# EAGLE design Particle Xenon Featherwing (EAGLE 9.1.1)

## Sheet 1 of 3: Sensors
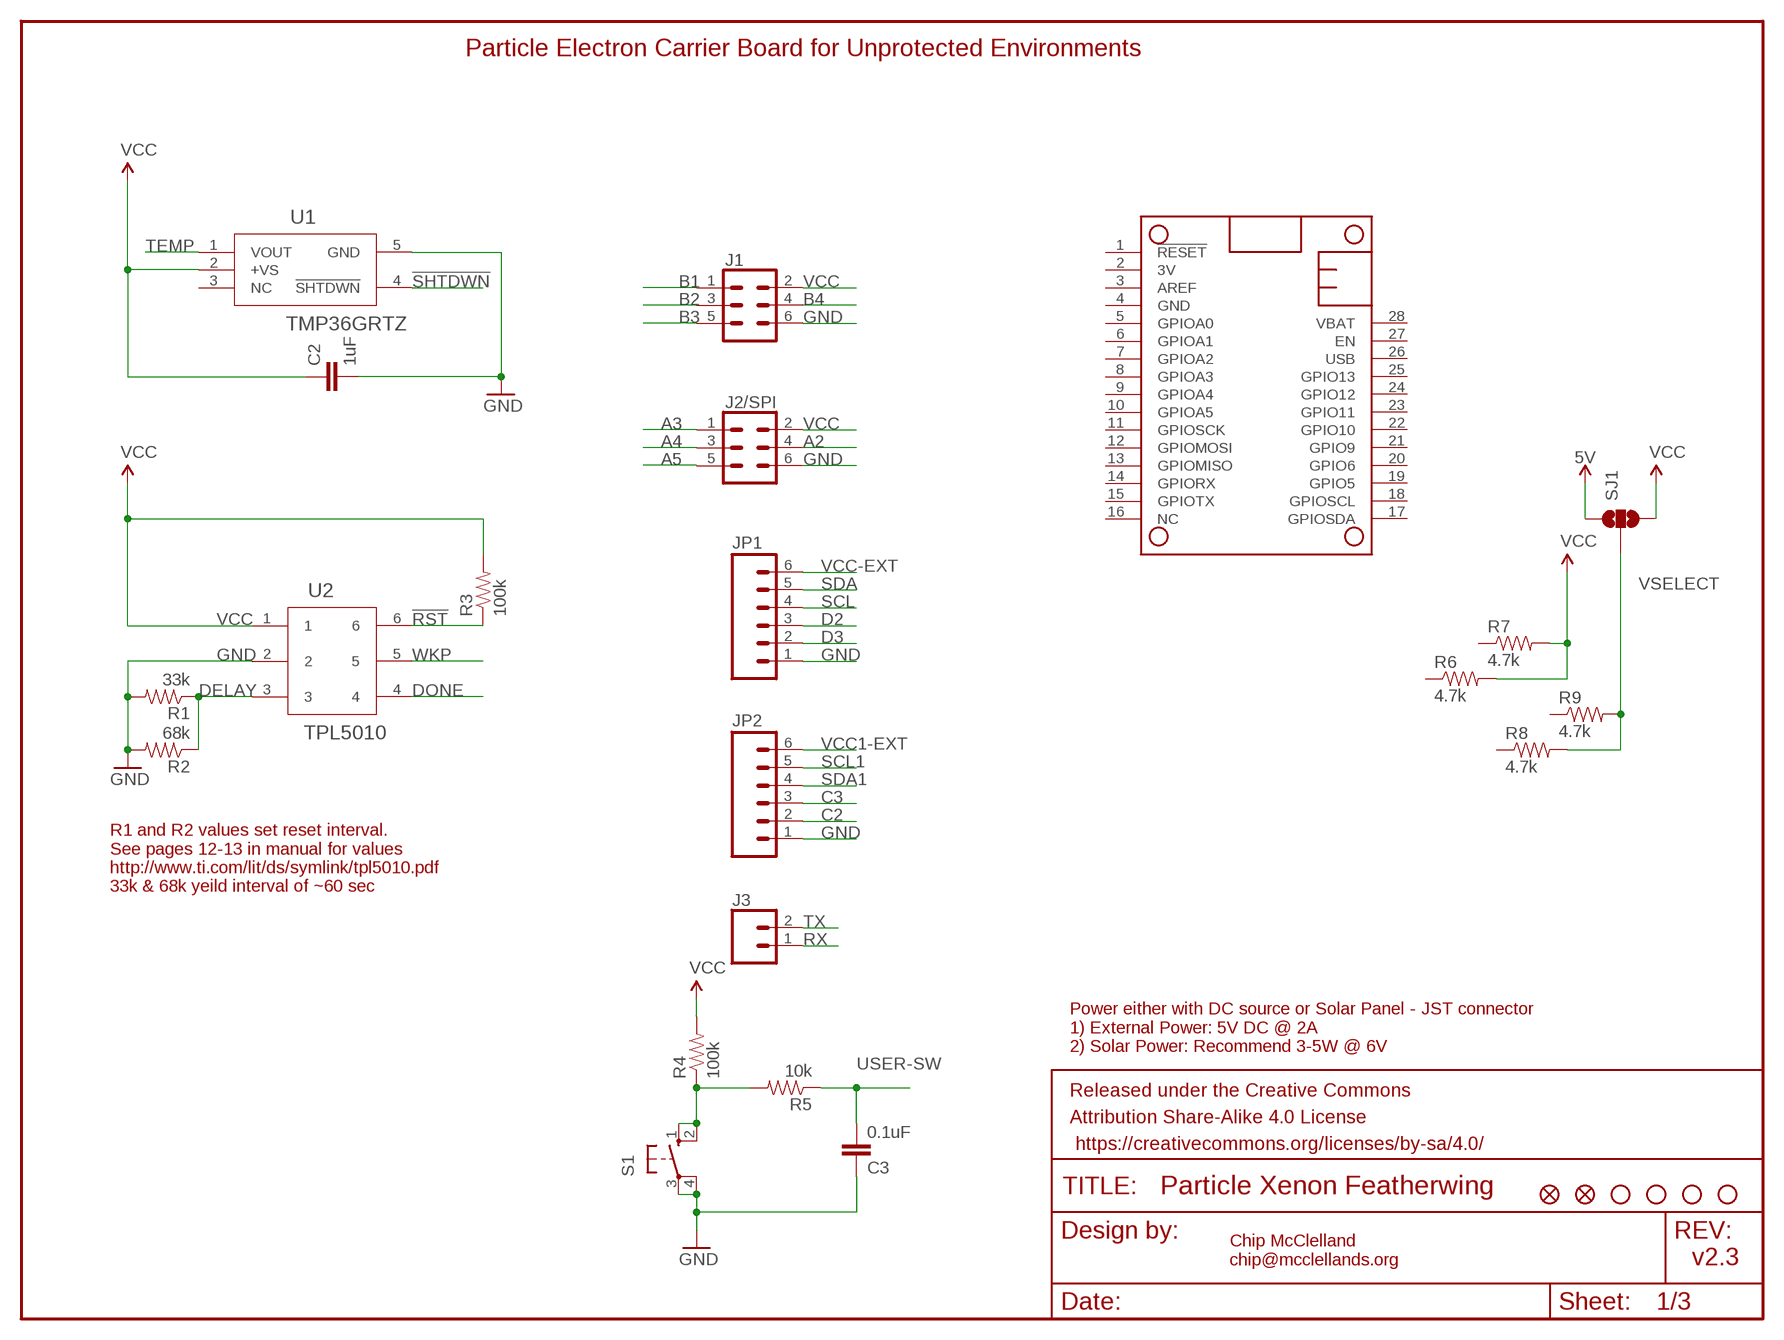
[diagram p0: schematic, sheet 1]

### Parts
C2  1uF  CAP0805  [0805@1]
C3  0.1uF  CAP0805  [0805@1]
FD1  FIDUCIALUFIDUCIAL  [FIDUCIAL-MICRO]
FD2  FIDUCIALUFIDUCIAL  [FIDUCIAL-MICRO]
FRAME1  FRAME-LETTER  [CREATIVE_COMMONS]
J1  CONN_03X22X3_SILK_MALE_PTH  [2X3]
J2/SPI  CONN_03X22X3_SILK_MALE_PTH  [2X3]
J3  CONN_02  [1X02]
JP1  M06LOCK  [1X06_LOCK]
JP2  M06LOCK  [1X06_LOCK]
JP3  STAND-OFF  [STAND-OFF]
JP4  STAND-OFF  [STAND-OFF]
JP5  STAND-OFF  [STAND-OFF]
JP6  STAND-OFF  [STAND-OFF]
MS2  FEATHERWING_NODIM  [FEATHERWING_DIM]
R1  33k  RESISTOR0805-RES  [0805]
R2  68k  RESISTOR0805-RES  [0805]
R3  100k  RESISTOR0805-RES  [0805]
R4  100k  RESISTOR0805-RES  [0805]
R5  10k  RESISTOR0805-RES  [0805]
R6  4.7k  RESISTOR0805-RES  [0805]
R7  4.7k  RESISTOR0805-RES  [0805]
R8  4.7k  RESISTOR0805-RES  [0805]
R9  4.7k  RESISTOR0805-RES  [0805]
S1  10-XX  [B3F-10XX]
SJ1  SOLDERJUMPER_2WAYPASTE1&2  [SJ_3_PASTE1&2]
U1  TMP36GRTZ  TMP36GRTZ-REEL7  [RJ_5]
U2  TPL5010  [TSOT-23]

### Nets
5V: SJ1.1
!RST: R3.1 U2.6
!SHTDWN: U1.4(!SHTDWN)
A2: J2/SPI.4
A3: J2/SPI.1
A4: J2/SPI.3
A5: J2/SPI.5
B1: J1.1
B2: J1.3
B3: J1.5
B4: J1.4
C2: JP2.2 ; also sheet 3
C3: JP2.3 ; also sheet 3
D2: JP1.3 ; also sheet 3
D3: JP1.2 ; also sheet 3
DELAY: R1.1 R2.1 U2.3
DONE: U2.4
GND: C2.2 C3.2 J1.6 J2/SPI.6 JP1.1 JP2.1 R1.2 R2.2 S1.3(P) S1.4(P1) U1.5(GND) U2.2 ; also sheet 2,3
N$4: R4.1 R5.2 S1.1(S) S1.2(S1)
RX: J3.1
SCL: JP1.4 ; also sheet 3
SCL1: JP2.5 ; also sheet 3
SDA: JP1.5 ; also sheet 3
SDA1: JP2.4 ; also sheet 3
TEMP: U1.1(VOUT)
TX: J3.2
USER-SW: C3.1 R5.1
VCC: C2.1 J1.2 J2/SPI.2 R3.2 R4.2 R6.2 R7.2 SJ1.3 U1.2(+VS) U2.1 ; also sheet 3
VCC1-EXT: JP2.6 ; also sheet 3
VCC-EXT: JP1.6 ; also sheet 3
VSELECT: R8.2 R9.2 SJ1.2 ; also sheet 3
WKP: U2.5
Unconnected: MS2.1(!RESET) MS2.2(3V) MS2.3(AREF) MS2.5(GPIOA0) MS2.6(GPIOA1) MS2.7(GPIOA2) MS2.8(GPIOA3) MS2.9(GPIOA4) MS2.10(GPIOA5) MS2.11(GPIOSCK) MS2.12(GPIOMOSI) MS2.13(GPIOMISO) MS2.14(GPIORX) MS2.15(GPIOTX) MS2.16(NC) MS2.17(GPIOSDA) MS2.18(GPIOSCL) MS2.19(GPIO5) MS2.20(GPIO6) MS2.21(GPIO9) MS2.22(GPIO10) MS2.23(GPIO11) MS2.24(GPIO12) MS2.25(GPIO13) MS2.26(USB) MS2.27(EN) MS2.28(VBAT) R6.1 R7.1 R8.1 R9.1 U1.3(NC)

### Notes on the sheet
- Particle Electron Carrier Board for Unprotected Environments
- R1 and R2 values set reset interval.
  See pages 12-13 in manual for values
  http://www.ti.com/lit/ds/symlink/tpl5010.pdf
  33k & 68k yeild interval of ~60 sec
- Power either with DC source or Solar Panel - JST connector
  1) External Power: 5V DC @ 2A 
  2) Solar Power: Recommend 3-5W @ 6V
- Chip McClelland
  chip@mcclellands.org
- v2.3

## Sheet 2 of 3: Power Control
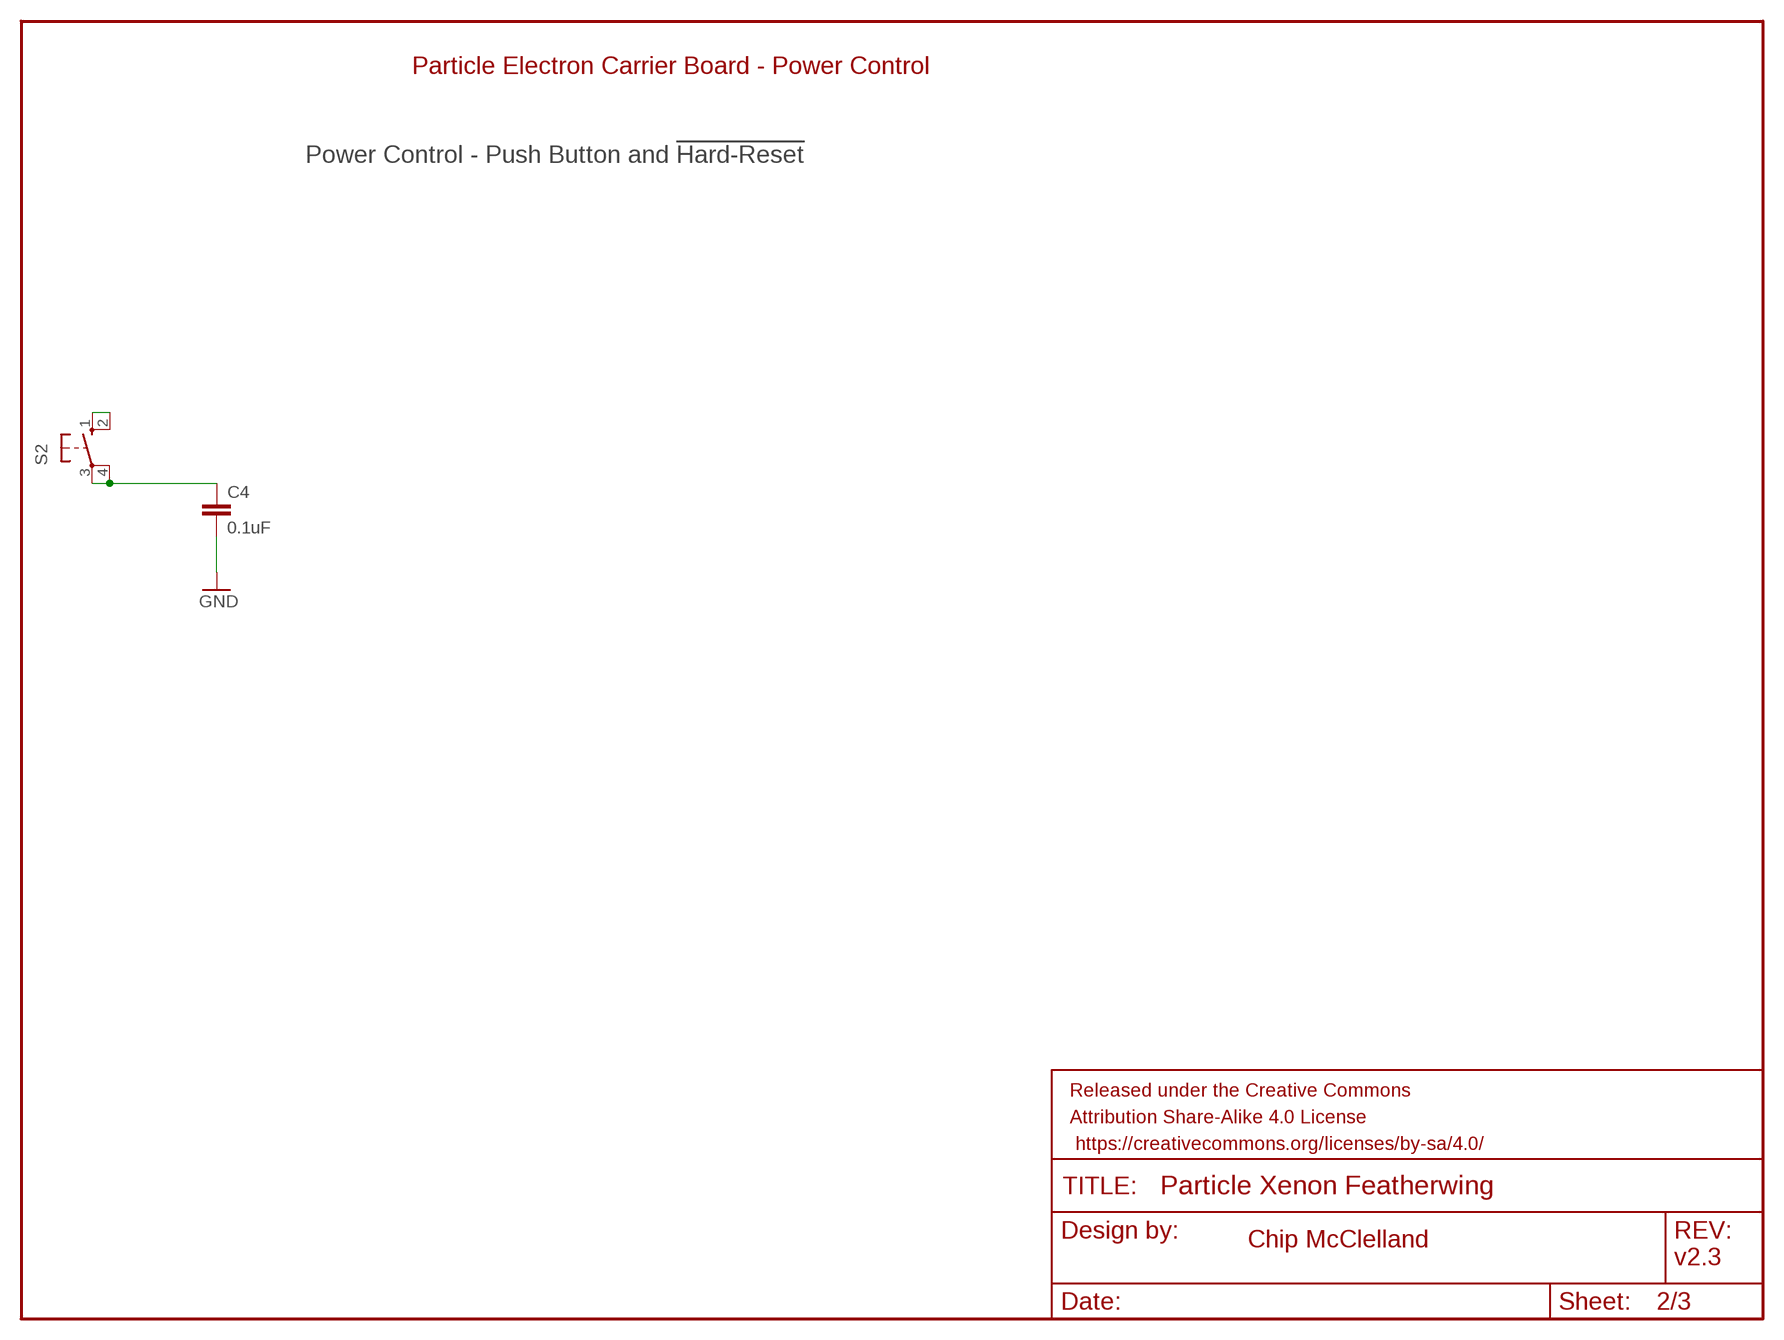
[diagram p1: schematic, sheet 2]

### Parts
C4  0.1uF  CAP0805  [0805@1]
FRAME2  FRAME-LETTER  [CREATIVE_COMMONS]
S2  40-XX-ROUND  [B3F-40XX-ROUND]

### Nets
GND: C4.2 ; also sheet 1,3
N$24: C4.1 S2.3(P) S2.4(P1)
N$25: S2.1(S) S2.2(S1)

### Notes on the sheet
- Particle Electron Carrier Board - Power Control
- Power Control - Push Button and !Hard-Reset
- Chip McClelland
- v2.3

## Sheet 3 of 3: Protection and 5V Boost
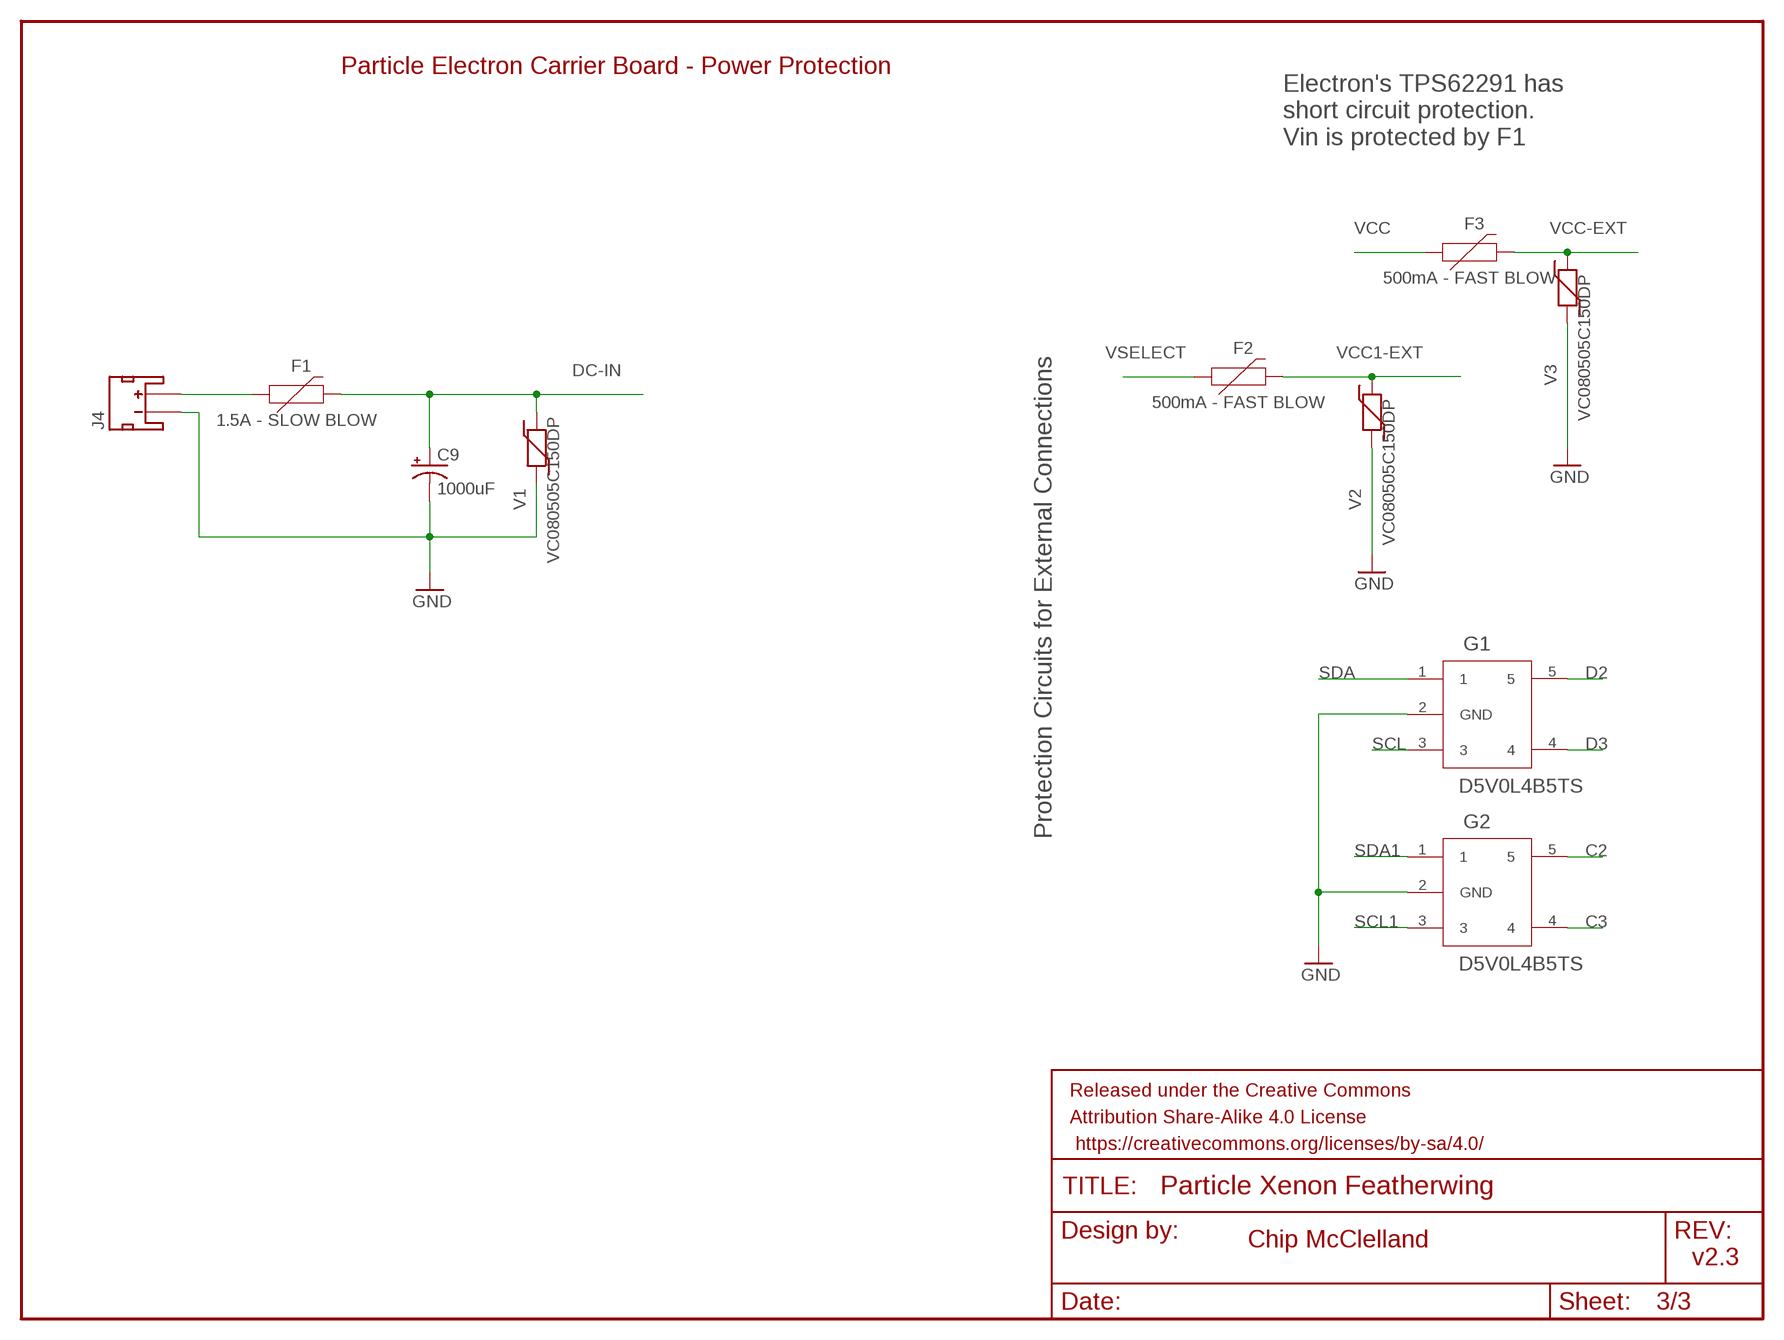
[diagram p2: schematic, sheet 3]

### Parts
C9  1000uF  CAP_POLG  [PANASONIC_G]
F1  1.5A - SLOW BLOW  PPTC_HALF-AMP  [1206]
F2  500mA - FAST BLOW  PPTC_HALF-AMP  [1206]
F3  500mA - FAST BLOW  PPTC_HALF-AMP  [1206]
FRAME3  FRAME-LETTER  [CREATIVE_COMMONS]
G1  D5V0L4B5TS  [SOT-23-5]
G2  D5V0L4B5TS  [SOT-23-5]
J4  5V @ 2A  JST_2MM_MALE  [JST-2-SMD]
V1  VC080505C150DP  VARISTOR  [0805]
V2  VC080505C150DP  VARISTOR  [0805]
V3  VC080505C150DP  VARISTOR  [0805]

### Nets
C2: G2.5 ; also sheet 1
C3: G2.4 ; also sheet 1
D2: G1.5 ; also sheet 1
D3: G1.4 ; also sheet 1
DC-IN: C9.+ F1.2 V1.2
DC-IN-EXT: F1.1 J4.2(+)
GND: C9.- G1.2(GND) G2.2(GND) J4.1(-) V1.1 V2.1 V3.1 ; also sheet 1,2
SCL: G1.3 ; also sheet 1
SCL1: G2.3 ; also sheet 1
SDA: G1.1 ; also sheet 1
SDA1: G2.1 ; also sheet 1
VCC: F3.1 ; also sheet 1
VCC1-EXT: F2.2 V2.2 ; also sheet 1
VCC-EXT: F3.2 V3.2 ; also sheet 1
VSELECT: F2.1 ; also sheet 1
Unconnected: J4.NC1(PAD1) J4.NC2(PAD2)

### Notes on the sheet
- Particle Electron Carrier Board - Power Protection
- Electron's TPS62291 has 
  short circuit protection. 
  Vin is protected by F1
- Protection Circuits for External Connections
- Chip McClelland
- v2.3

## Power pins joined to a net without a drawn wire
GND: MS2.4(GND)

## Library data of the parts
C2-C4 = SparkFun-Capacitors:CAP: Capacitor Standard 0603 ceramic capacitor, and 0.1" leaded capacitor.
C9 = SparkFun-Capacitors:CAP_POL: Capacitor Polarized These are standard SMD and PTH capacitors. Normally 10uF, 47uF, and 100uF in electrolytic and tantalum varieties. Always verify the external diameter of the through hole cap, it varies with capacity, voltage, and manufacturer. The EIA devices should be standard.
F1-F3 = SparkFun-Fuses:PPTC: Resettable Fuse PPTC Resettable Fuse. Really a sort of resistor with a polymeric positive temperature coefficient whose resistance increases dramatically with an increase in temperature. When heated by the power passing through the resistance rises causing the current to be limited, protecting the circuit. This is achieved by the transition of the polymer from a crystalline to an amorphous state where the conductive carbon separates breaking the conductive pathways found in the cool crystalline structure. When a PPTC cools back down it resumes conducting letting the circuit turn back on. SparkFun Products: SparkFun RedBoard - Programmed with Arduino <https://www.sparkfun.com/products/12757> Pro Micro - 5V/16MHz <https://www.sparkfun.com/products/12640> Arduino Pro 328 - 5V/16MHz <https://www.sparkfun.com/products/10915> MP3 Trigger <https://www.sparkfun.com/products/13720>; PROD_ID: RES-08585; VALUE: 6V/0.5A
FD1 FD2 = SparkFun-Aesthetics:FIDUCIAL: Fiducial Alignment Points Point-of-reference for pick-and-place machines and other optical instruments.
FRAME1-FRAME3 = SparkFun-Aesthetics:FRAME-LETTER: Schematic Frame - Letter Standard 8.5x11 US Letter frame
G1 G2 = Custom Components:D5V0L4B5TS: 4 CHANNEL LOW CAPACITANCE BI-DIRECTIONAL TVS ARRAY
J1 J2/SPI = SparkFun-Connectors:CONN_03X2: Multi connection point. Often used as Generic Header-pin footprint for 0.1 inch spaced/style header connections You can populate with any combo of single row headers, but if you'd like an exact match, check these: Header - 2x3 (Male, 0.1") <https://www.sparkfun.com/products/12807> (PRT-12807) Header - 2x3 (Female, 0.1") <https://www.sparkfun.com/products/13010> (PRT-13010) 2x3 Pin Shrouded Header <https://www.sparkfun.com/products/10877> (PRT-10877) On any of the 0.1 inch spaced packages, you can populate with these: Break Away Headers - Straight <https://www.sparkfun.com/products/116> (PRT-00116) Break Away Male Headers - Right Angle <https://www.sparkfun.com/products/553> (PRT-00553) Female Headers <https://www.sparkfun.com/products/115> (PRT-00115) Break Away Headers - Machine Pin <https://www.sparkfun.com/products/117> (PRT-00117) Break Away Female Headers - Swiss Machine Pin <https://www.sparkfun.com/products/743> (PRT-00743) Special note: the shrouded connector mates well with our 3x2 ribbon cables: Ribbon Crimp Connector - 6-pin (2x3, Female) <https://www.sparkfun.com/products/10651> (PRT-10651) Ribbon Cable - 6 wire (15ft) <https://www.sparkfun.com/products/10646> (PRT-10646); PROD_ID: CONN-09701
J3 = SparkFun-Connectors:CONN_02: Multi connection point. Often used as Generic Header-pin footprint for 0.1 inch spaced/style header connections On any of the 0.1 inch spaced packages, you can populate with these: Break Away Headers - Straight <https://www.sparkfun.com/products/116> (PRT-00116) Break Away Male Headers - Right Angle <https://www.sparkfun.com/products/553> (PRT-00553) Female Headers <https://www.sparkfun.com/products/115> (PRT-00115) Break Away Headers - Machine Pin <https://www.sparkfun.com/products/117> (PRT-00117) Break Away Female Headers - Swiss Machine Pin <https://www.sparkfun.com/products/743> (PRT-00743) For SCREWTERMINALS and SPRING TERMINALS visit here: Screw Terimnals on SparkFun.com <https://www.sparkfun.com/search/results?term=Screw+Terminals> (5mm/3.5mm/2.54mm spacing) This device is also useful as a general connection point to wire up your design to another part of your project. Our various solder wires solder well into these plated through hole pads. Hook-Up Wire - Assortment (Stranded, 22 AWG) <https://www.sparkfun.com/products/11375> (PRT-11375) Hook-Up Wire - Assortment (Solid Core, 22 AWG) <https://www.sparkfun.com/products/11367> (PRT-11367) View the entire wire category on our website here <https://www.sparkfun.com/categories/141> Special notes: Molex polarized connector foot print use with: PRT-08233 with associated crimp pins and housings. 2.54_SCREWTERM for use with PRT-10571. 3.5mm Screw Terminal footprints for PRT-08084 5mm Screw Terminal footprints for use with PRT-08432
J4 = SparkFun-Connectors:JST_2MM_MALE: JST 2MM MALE RA CONNECTOR Two pin, compact surface mount connector. Commonly used as a battery input connection point. We really like the solid locking feeling and high current rating on these small connectors. We use these all the time as battery connectors. Mates to single-cell LiPo batteries. Here is the connector we sell at SparkFun: JST Right Angle Connector - White <https://www.sparkfun.com/products/8612> (PRT-08612) Datasheet <http://www.sparkfun.com/datasheets/Prototyping/Connectors/JST-Horizontal.pdf> It was used on these SparkFun products: SparkFun MOSFET Power Controller <https://www.sparkfun.com/products/11214> (PRT-11214) SparkFun Battery Babysitter - LiPo Battery Manager <https://www.sparkfun.com/products/13777> (PRT-13777) And many, many others that required a lipo battery connection.; PROD_ID: CONN-11443; SF_ID: PRT-08612
JP1 JP2 = SparkFun-Connectors:M06: Header 6 Standard 6-pin 0.1" header. Use with straight break away headers (SKU : PRT-00116), right angle break away headers (PRT-00553), swiss pins (PRT-00743), machine pins (PRT-00117), and female headers (PRT-00115). Molex polarized connector foot print use with SKU : PRT-08094 with associated crimp pins and housings. NOTES ON THE VARIANTS LOCK and LOCK_LONGPADS... This footprint was designed to help hold the alignment of a through-hole component (i.e. 6-pin header) while soldering it into place. You may notice that each hole has been shifted either up or down by 0.005 of an inch from it's more standard position (which is a perfectly straight line). This slight alteration caused the pins (the squares in the middle) to touch the edges of the holes. Because they are alternating, it causes a "brace" to hold the component in place. 0.005 has proven to be the perfect amount of "off-center" position when using our standard breakaway headers. Although looks a little odd when you look at the bare footprint, once you have a header in there, the alteration is very hard to notice. Also,if you push a header all the way into place, it is covered up entirely on the bottom side. This idea of altering the position of holes to aid alignment will be further integrated into the Sparkfun Library for other footprints. It can help hold any component with 3 or more connection pins.
JP3-JP6 = SparkFun:STAND-OFF: Stand Off This is the mechanical footprint for a #4 phillips button head screw. Use the keepout ring to avoid running the screw head into surrounding components. SKU : PRT-00447
MS2 = microbuilder:FEATHERWING
R1-R9 = SparkFun-Passives:RESISTOR: Resistor Basic schematic elements and footprints for 0603, 1206, and PTH resistors.
S1 = switch-omron:10-XX: OMRON SWITCH
S2 = adafruit:40-XX: OMRON SWITCH
SJ1 = SparkFun-Passives:SOLDERJUMPER_2WAY: Solder Jumper 2 way solder jumper
U1 = TMP36:TMP36GRTZ-REEL7; MANUFACTURER_PART_NUMBER: TMP36GRTZREEL7; VENDOR: Analog Devices Inc
U2 = Custom Components:TPL5010
V1-V3 = Custom Components:VARISTOR

## Net classes
0 default: width 0.203 mm, drill 0.33 mm

## Board
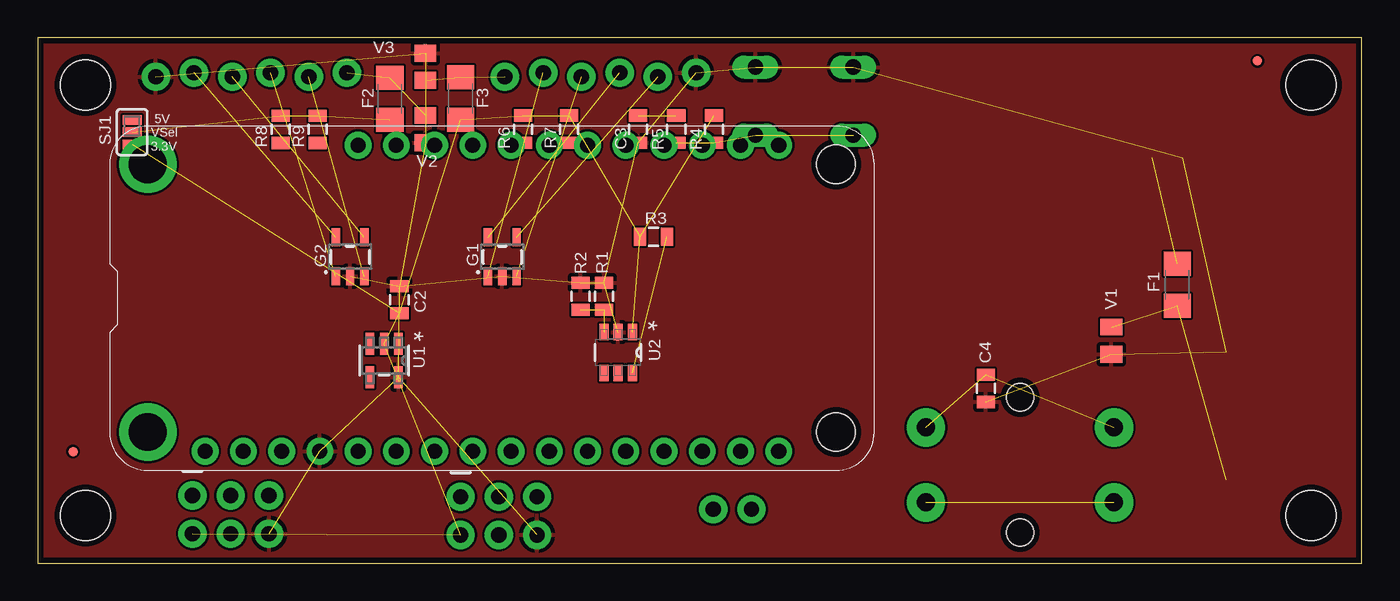
[diagram p3: board, top side]
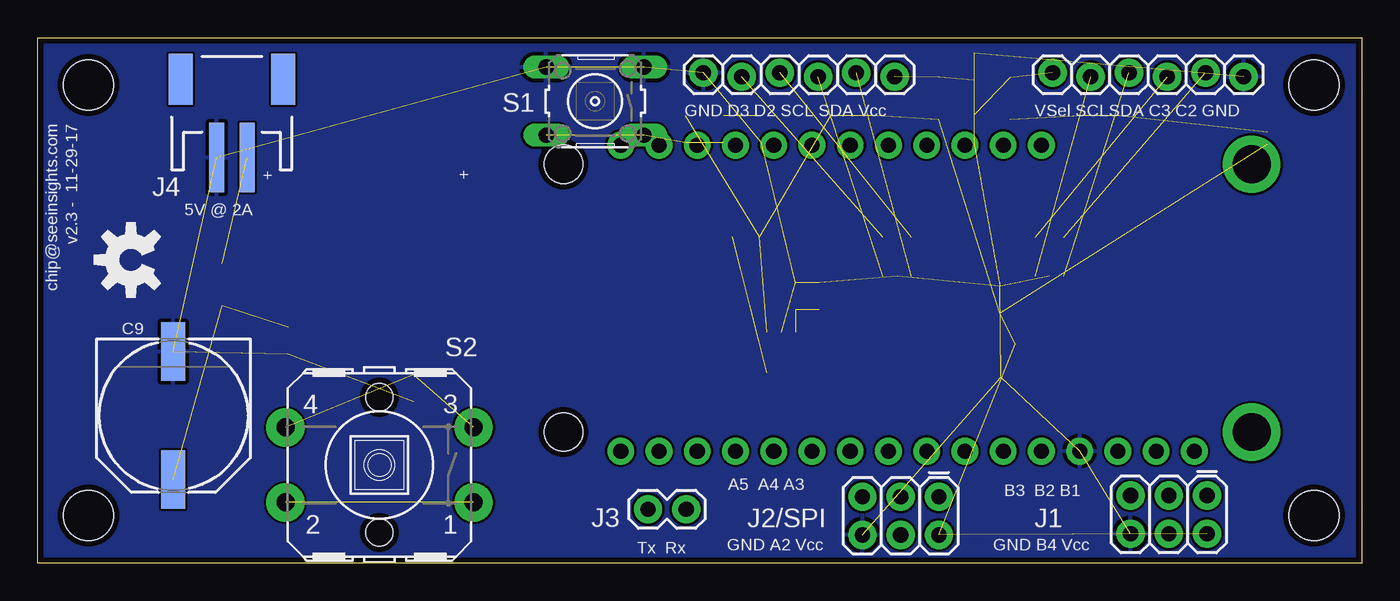
[diagram p4: board, bottom side, seen from below]

Size 87.96 x 34.9 mm. Coordinates in mm from the lower left corner, seen from the top.
Outline: 0,0 87.96,0 87.96,34.9 0,34.9 0,0
Copper layers (1*16): Top 0.0356mm / dielectric 1.5011mm / Bottom 0.0356mm
Design rules "LaenPCBOrder": minimum track width 6mil, minimum drill 13mil, track to track 6mil, track to pad 6mil, pad to pad 6mil, via to via 6mil, smd to smd 6mil, copper to edge 15mil, drill to drill 6mil, minimum pad ring 7mil, minimum via ring 7mil, stop-mask expansion 3mil, vias tented up to drill 0mil, thermal gap 10mil

### Footprints (pad centres in the part's own frame; a part is rotated, then mirrored left to right if it is on the bottom)
0805@1 = smd 0.8 x 1.2: 1 -0.9,0; 2 0.9,0
PANASONIC_G = smd 3.9 x 1.6: + 4.25,0; - -4.25,0
1206 = smd 1.6 x 1.8: 1 -1.4,0; 2 1.4,0
FIDUCIAL-MICRO = smd 0.635 x 0.635: 1 0,0
SOT-23-5 = smd 0.55 x 1.2: 1 -0.95,-1.3; 2 0,-1.3; 3 0.95,-1.3; 4 0.95,1.3; 5 -0.95,1.3
2X3 = drill 1.016 pad 1.88: 1 0,0; 2 0,2.54; 3 2.54,0; 4 2.54,2.54; 5 5.08,0; 6 5.08,2.54
1X02 = drill 1.016 pad 1.88: 1 0,0; 2 2.54,0
JST-2-SMD = smd 1 x 4.6: 1 -1,-3.7; 2 1,-3.7 | smd 1.6 x 3.4: NC1 -3.4,1.5; NC2 3.4,1.5
1X06_LOCK = drill 1.016 pad 1.88: 1 0,0; 2 2.54,-0.254; 3 5.08,0; 4 7.62,-0.254; 5 10.16,0; 6 12.7,-0.254
STAND-OFF = hole 3.302: 0,0
FEATHERWING_DIM = drill 1 pad 1.778: 1 6.35,1.27; 2 8.89,1.27; 3 11.43,1.27; 4 13.97,1.27; 5 16.51,1.27; 6 19.05,1.27; 7 21.59,1.27; 8 24.13,1.27; 9 26.67,1.27; 10 29.21,1.27; 11 31.75,1.27; 12 34.29,1.27; 13 36.83,1.27; 14 39.37,1.27; 15 41.91,1.27; 16 44.45,1.27; 17 44.45,21.59; 18 41.91,21.59; 19 39.37,21.59; 20 36.83,21.59; 21 34.29,21.59; 22 31.75,21.59; 23 29.21,21.59; 24 26.67,21.59; 25 24.13,21.59; 26 21.59,21.59; 27 19.05,21.59; 28 16.51,21.59 | drill 2.5 pad 3.81: P$1 2.54,20.32; P$2 2.54,2.54 | hole 2.54: 48.26,20.32; 48.26,2.54
0805 = smd 0.8 x 1.2: 1 -0.9,0; 2 0.9,0
B3F-10XX = drill 1.016 long: 1 -3.251,2.261; 2 3.251,2.261; 3 -3.251,-2.261; 4 3.251,-2.261
B3F-40XX-ROUND = drill 1.194 pad 2.54: 1 -6.248,2.489; 2 6.248,2.489; 3 -6.248,-2.489; 4 6.248,-2.489 | hole 1.803: 0,-4.496; 0,4.496
SJ_3_PASTE1&2 = smd 0.635 x 1.27: 1 -0.813,0; 2 0,0; 3 0.813,0
RJ_5 = smd 1.473 x 0.559: 1 -1.118,0.95; 2 -1.118,0; 3 -1.118,-0.95; 4 1.118,-0.95; 5 1.118,0.95
TSOT-23 = smd 1.1 x 0.6: 1 -1.35,0.95; 2 -1.35,0; 3 -1.35,-0.94; 4 1.35,-0.95; 5 1.35,0; 6 1.35,0.95
0805' = smd 1.118 x 1.448: 1 -0.902,0; 2 0.902,0

### Placement (x,y rotation side)
C2  24.03,17.5 90 top
C3  39.88,28.83 270 top
C4  62.99,11.61 270 top
C9  78.94,9.8 270 bottom
F1  75.69,18.49 270 top
F2  23.39,30.84 90 top
F3  28.09,30.86 90 top
FD1  81.03,33.35 0 top
FD2  2.36,7.42 0 top
FRAME1  0.03,-11.81 0 top  (outside the outline)
FRAME2  0.03,-20.29 0 top  (outside the outline)
FRAME3  0.03,-28.78 0 top  (outside the outline)
G1  30.86,20.35 0 top
G2  20.75,20.35 0 top
J1  10.29,4.5 180 bottom
J2/SPI  28.09,4.42 180 bottom
J3  44.88,3.58 180 bottom
J4  75.06,30.63 0 bottom
JP1  43.74,32.56 0 bottom
JP2  7.85,32.31 180 bottom
JP3  84.58,31.75 0 top
JP4  84.58,3.17 90 top
JP5  3.17,31.75 0 top
JP6  3.17,3.17 0 top
MS2  4.78,6.17 0 top
R1  37.62,17.73 90 top
R2  36.07,17.73 90 top
R3  40.92,21.67 180 top
R4  44.93,28.83 90 top
R5  42.42,28.83 270 top
R6  32.26,28.83 90 top
R7  35.31,28.83 90 top
R8  16.13,28.8 90 top
R9  18.59,28.8 90 top
S1  50.93,30.68 180 bottom
S2  65.25,6.53 180 bottom
SJ1  6.27,28.63 270 top
U1  23.01,13.46 270 top
U2  38.56,14 270 top
U$2  [OSHW-LOGO-M]  81.76,20.14 90 bottom
V1  VC080505C150DP  [0805']  71.32,14.78 90 top
V2  VC080505C150DP  [0805']  25.76,28.83 90 top
V3  VC080505C150DP  [0805']  25.76,32.97 270 top

### Tracks (layer width: path | path; a pad name or v marks a point on that pad's centre or on a via)
!RST  (1 unrouted)
C2  (1 unrouted)
C3  (1 unrouted)
D2  (1 unrouted)
D3  (1 unrouted)
DC-IN  (2 unrouted)
DC-IN-EXT  (1 unrouted)
DELAY  (2 unrouted)
GND  (20 unrouted)
  pour Top (rank 2): -3.78,37.29 90.42,37.47 90.37,-2.01 -3.78,-2.18
  pour Bottom: -4.39,38.3 91.31,38.15 91.14,-2.41 -4.22,-2.39
N$4  (3 unrouted)
N$24  (2 unrouted)
N$25  (1 unrouted)
SCL  (1 unrouted)
SCL1  (1 unrouted)
SDA  (1 unrouted)
SDA1  (1 unrouted)
USER-SW  (1 unrouted)
VCC  (10 unrouted)
VCC1-EXT  (2 unrouted)
VCC-EXT  (2 unrouted)
VSELECT  (3 unrouted)

### Text on the board
tNames: 5V / VSel / 3.3V
bNames: VSel SCLSDA C3 C2 GND | GND D3 D2 SCL SDA Vcc | v2.3 - 11-29-17 | chip@seeinsights.com | + | + | A5 A4 A3 | B3 B2 B1 | GND B4 Vcc | GND A2 Vcc | Tx Rx